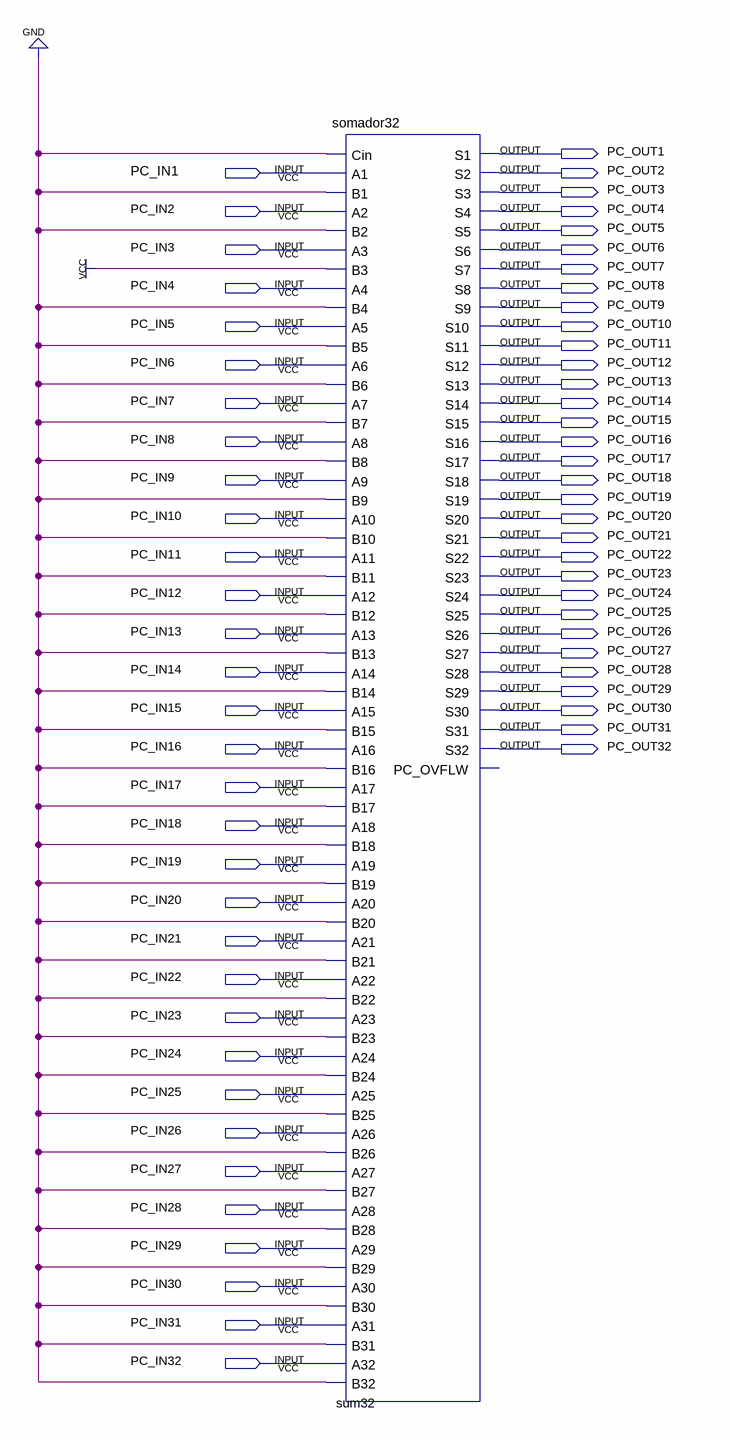
[diagram p0: schematic sheet]
// Quartus schematic pc4.bdf as structural Verilog: 1 symbols, 64 pins
module pc4 (
  input  PC_IN1,
  input  PC_IN2,
  input  PC_IN3,
  input  PC_IN4,
  input  PC_IN5,
  input  PC_IN6,
  input  PC_IN7,
  input  PC_IN8,
  input  PC_IN9,
  input  PC_IN10,
  input  PC_IN11,
  input  PC_IN12,
  input  PC_IN13,
  input  PC_IN14,
  input  PC_IN15,
  input  PC_IN16,
  input  PC_IN17,
  input  PC_IN18,
  input  PC_IN19,
  input  PC_IN20,
  input  PC_IN21,
  input  PC_IN22,
  input  PC_IN23,
  input  PC_IN24,
  input  PC_IN25,
  input  PC_IN26,
  input  PC_IN27,
  input  PC_IN28,
  input  PC_IN29,
  input  PC_IN30,
  input  PC_IN31,
  input  PC_IN32,
  output PC_OUT1,
  output PC_OUT2,
  output PC_OUT3,
  output PC_OUT4,
  output PC_OUT5,
  output PC_OUT6,
  output PC_OUT7,
  output PC_OUT8,
  output PC_OUT9,
  output PC_OUT10,
  output PC_OUT11,
  output PC_OUT12,
  output PC_OUT13,
  output PC_OUT14,
  output PC_OUT15,
  output PC_OUT16,
  output PC_OUT17,
  output PC_OUT18,
  output PC_OUT19,
  output PC_OUT20,
  output PC_OUT21,
  output PC_OUT22,
  output PC_OUT23,
  output PC_OUT24,
  output PC_OUT25,
  output PC_OUT26,
  output PC_OUT27,
  output PC_OUT28,
  output PC_OUT29,
  output PC_OUT30,
  output PC_OUT31,
  output PC_OUT32
);

  somador32 sum32 (
    .Cin(1'b0), .A1(PC_IN1), .B1(1'b0), .A2(PC_IN2), .B2(1'b0), .A3(PC_IN3), .B3(1'b1), .A4(PC_IN4),
    .B4(1'b0), .A5(PC_IN5), .B5(1'b0), .A6(PC_IN6), .B6(1'b0), .A7(PC_IN7), .B7(1'b0), .A8(PC_IN8),
    .B8(1'b0), .A9(PC_IN9), .B9(1'b0), .A10(PC_IN10), .B10(1'b0), .A11(PC_IN11), .B11(1'b0), .A12(PC_IN12),
    .B12(1'b0), .A13(PC_IN13), .B13(1'b0), .A14(PC_IN14), .B14(1'b0), .A15(PC_IN15), .B15(1'b0),
    .A16(PC_IN16), .B16(1'b0), .A17(PC_IN17), .B17(1'b0), .A18(PC_IN18), .B18(1'b0), .A19(PC_IN19),
    .B19(1'b0), .A20(PC_IN20), .B20(1'b0), .A21(PC_IN21), .B21(1'b0), .A22(PC_IN22), .B22(1'b0),
    .A23(PC_IN23), .B23(1'b0), .A24(PC_IN24), .B24(1'b0), .A25(PC_IN25), .B25(1'b0), .A26(PC_IN26),
    .B26(1'b0), .A27(PC_IN27), .B27(1'b0), .A28(PC_IN28), .B28(1'b0), .A29(PC_IN29), .B29(1'b0),
    .A30(PC_IN30), .B30(1'b0), .A31(PC_IN31), .B31(1'b0), .A32(PC_IN32), .B32(1'b0), .S1(PC_OUT1),
    .S2(PC_OUT2), .S3(PC_OUT3), .S4(PC_OUT4), .S5(PC_OUT5), .S6(PC_OUT6), .S7(PC_OUT7), .S8(PC_OUT8),
    .S9(PC_OUT9), .S10(PC_OUT10), .S11(PC_OUT11), .S12(PC_OUT12), .S13(PC_OUT13), .S14(PC_OUT14),
    .S15(PC_OUT15), .S16(PC_OUT16), .S17(PC_OUT17), .S18(PC_OUT18), .S19(PC_OUT19), .S20(PC_OUT20),
    .S21(PC_OUT21), .S22(PC_OUT22), .S23(PC_OUT23), .S24(PC_OUT24), .S25(PC_OUT25), .S26(PC_OUT26),
    .S27(PC_OUT27), .S28(PC_OUT28), .S29(PC_OUT29), .S30(PC_OUT30), .S31(PC_OUT31), .S32(PC_OUT32));  // open: PC_OVFLW
endmodule
